# EAGLE design RH034.2 (EAGLE 7.7.0)
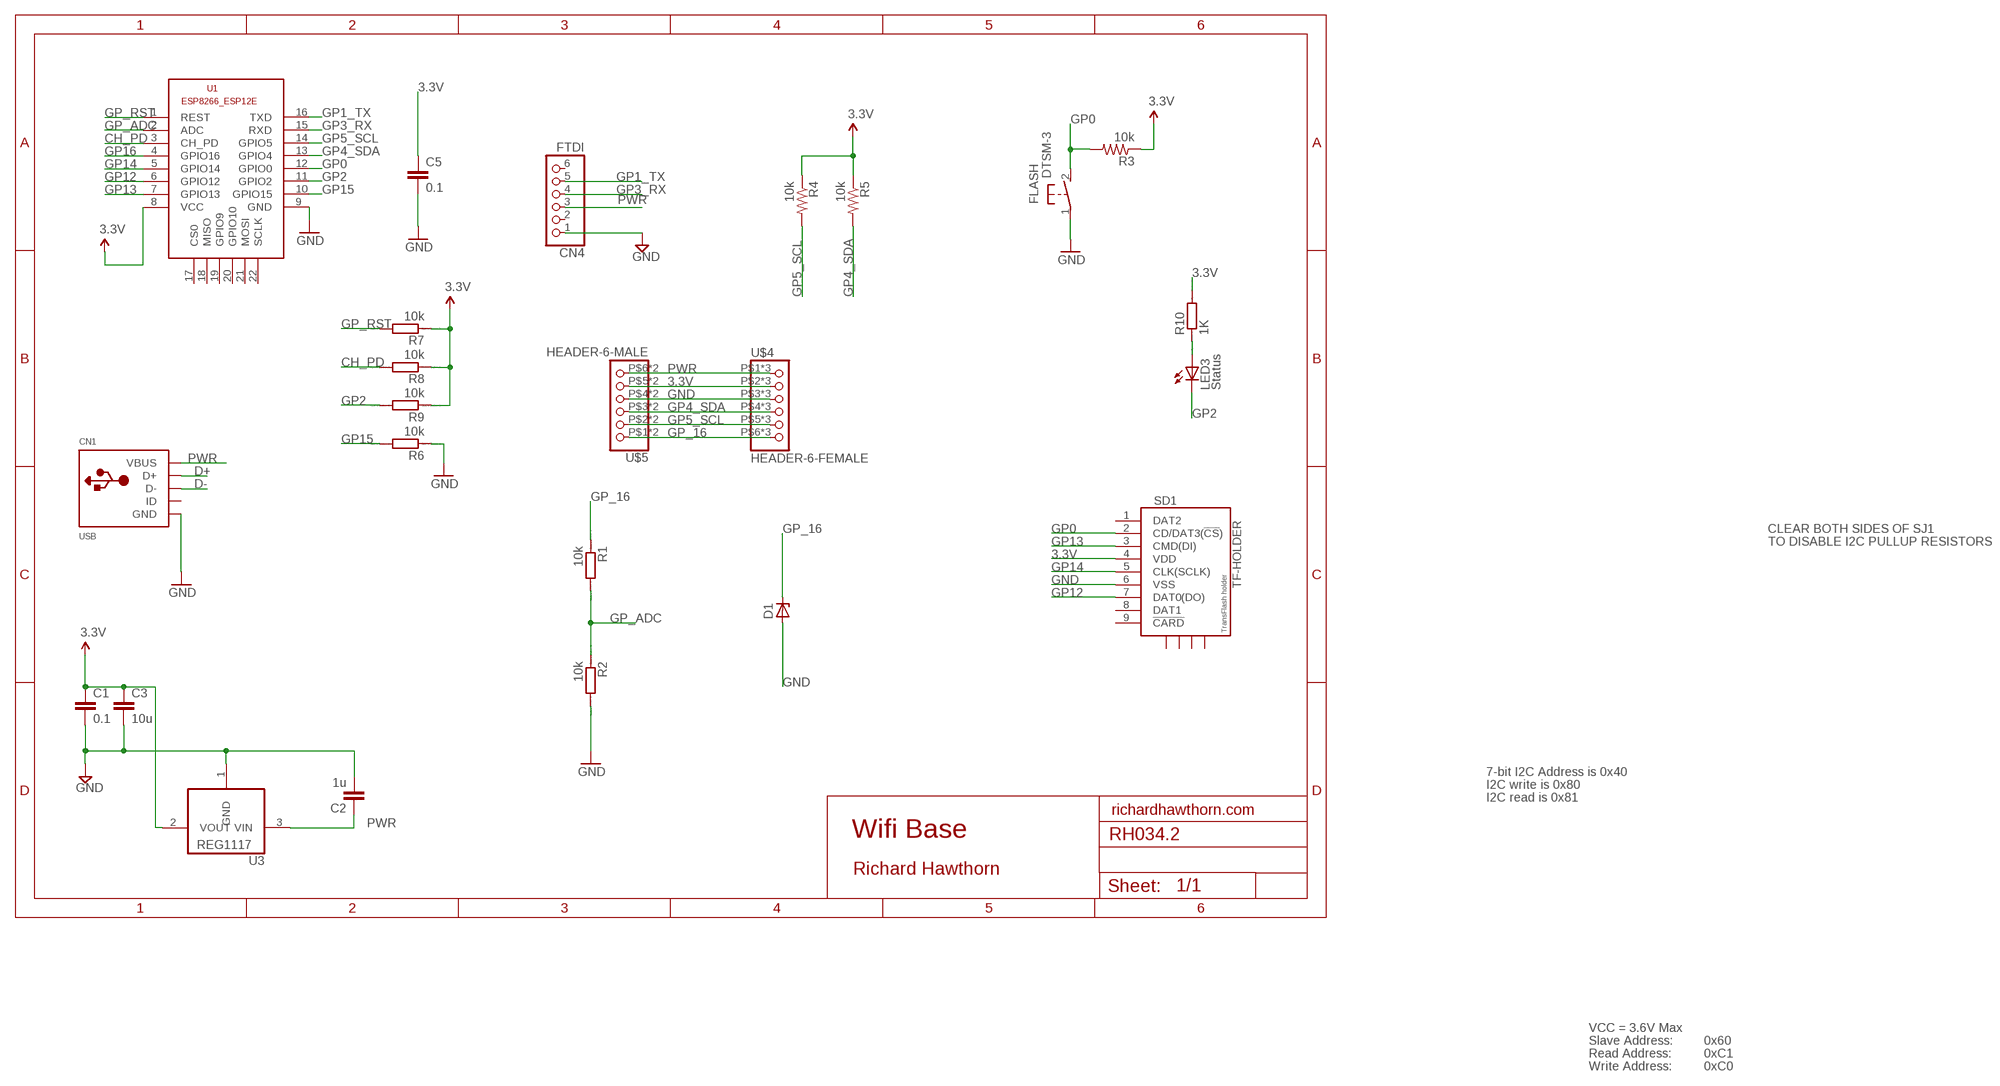
[diagram p0: schematic, sheet 1]

## Parts
C1  0.1  CAP0603-CAP  [0603-CAP]
C2  1u  CAP0603-CAP  [0603-CAP]
C3  10u  CAP0805-CAP  [0805-CAP]
C5  0.1  CAP0603-CAP  [0603-CAP]
CN1  USB  USBMINIB  [USB-MINIB]
CN4  FTDI  PINHD-1X6  [1X06]
D1  ZENER-DIODESOT23  [SOT23]
FLASH  DTSM-3  [DTSM-3]
LED3  Status  LEDCHIPLED_0805  [CHIPLED_0805]
R1  10k  R-EU_R0603  [R0603]
R2  10k  R-EU_R0603  [R0603]
R3  10k  RESISTOR0805-RES  [0805]
R4  10k  RESISTOR0805-RES  [0805]
R5  10k  RESISTOR0805-RES  [0805]
R6  10k  R-EU_R0603  [R0603]
R7  10k  R-EU_R0603  [R0603]
R8  10k  R-EU_R0603  [R0603]
R9  10k  R-EU_R0603  [R0603]
R10  1K  R-EU_R0603  [R0603]
SD1  TF-HOLDER  [TF-PULL]
U1  ESP8266-12EESP8266-ESP12E  [ESP8266-ESP12E]
U3  REG1117  [SOT223]
U$4  HEADER-6-FEMALE  [2MMHEADER6]
U$5  HEADER-6-MALE  [2MMHEADERPIN6]

## Nets
3.3V: C1.1 C3.1 C5.1 R3.1 R4.1 R5.1 R7.1 R8.1 R9.1 R10.2 SD1.4(VDD) U1.8(VCC) U3.2(VOUT) U$4.P$2 U$4.P$10 U$4.P$18 U$5.P$5 U$5.P$13
CH_PD: R8.2 U1.3(CH_PD)
D+: CN1.D+
D-: CN1.D-
GND [power]: C1.2 C2.2 C3.2 C5.2 CN1.GND CN4.1 D1.1(A) FLASH.1 R2.2 R6.1 SD1.6(VSS) U1.9(GND) U3.1(GND) U$4.P$3 U$4.P$11 U$4.P$19 U$5.P$4 U$5.P$12
GP0: FLASH.2 R3.2 SD1.2(CD/DAT3(!CS!)) U1.12(GPIO0)
GP1_TX: CN4.5 U1.16(TXD)
GP2: LED3.C R9.2 U1.11(GPIO2)
GP3_RX: CN4.4 U1.15(RXD)
GP4_SDA: R5.2 U1.13(GPIO4) U$4.P$4 U$4.P$12 U$4.P$20 U$5.P$3 U$5.P$11
GP5_SCL: R4.2 U1.14(GPIO5) U$4.P$5 U$4.P$13 U$4.P$21 U$5.P$2 U$5.P$10
GP12: SD1.7(DAT0(DO)) U1.6(GPIO12)
GP13: SD1.3(CMD(DI)) U1.7(GPIO13)
GP14: SD1.5(CLK(SCLK)) U1.5(GPIO14)
GP15: R6.2 U1.10(GPIO15)
GP16: U1.4(GPIO16)
GP_16: D1.3(C) R1.1 U$4.P$6 U$4.P$14 U$4.P$22 U$5.P$1 U$5.P$9
GP_ADC: R1.2 R2.1 U1.2(ADC)
GP_RST: R7.2 U1.1(REST)
N$1: LED3.A R10.1
PWR [power]: C2.1 CN1.VBUS CN4.3 U3.3(VIN) U$4.P$1 U$4.P$9 U$4.P$17 U$5.P$6 U$5.P$14
Unconnected: CN1.ID CN4.2 CN4.6 SD1.1(DAT2) SD1.8(DAT1) SD1.9(!CARD) SD1.S1 SD1.S2 SD1.S3 SD1.S4 U1.17(CS0) U1.18(MISO) U1.19(GPIO9) U1.20(GPIO10) U1.21(MOSI) U1.22(SCLK)

## Notes on the sheet
- CLEAR BOTH SIDES OF SJ1
- TO DISABLE I2C PULLUP RESISTORS
- 7-bit I2C Address is 0x40
- I2C write is 0x80
- I2C read is 0x81
- richardhawthorn.com
- Wifi Base
- Richard Hawthorn
- VCC = 3.6V Max
- Slave Address: | 0x60
- Read Address: | 0xC1
- Write Address: | 0xC0

## Library data of the parts
C1-C3 C5 = LowPowerLab:CAP: Capacitor Standard 0603 ceramic capacitor, and 0.1" leaded capacitor.
CN1 = LowPowerLab:USB: USB Connectors USBMINIB - Surface Mount Female Mini-B USB Connector 4UConnector: 06564 By microbuilder.eu Thru-hole RA Female Mini-B USB Connector 4UConnector: 18732 By ladyada.net
CN4 = Richards:PINHD-1X6: PIN HEADER
D1 = diode:ZENER-DIODE: Z-Diode
FLASH = switch-tact:DTSM-3
LED3 = led:LED: LED OSRAM: - CHIPLED LG R971, LG N971, LY N971, LG Q971, LY Q971, LO R971, LY R971 LH N974, LH R974 LS Q976, LO Q976, LY Q976 LO Q996 - Hyper CHIPLED LW Q18S LB Q993, LB Q99A, LB R99A - SideLED LS A670, LO A670, LY A670, LG A670, LP A670 LB A673, LV A673, LT A673, LW A673 LH A674 LY A675 LS A676, LA A676, LO A676, LY A676, LW A676 LS A679, LY A679, LG A679 - Hyper Micro SIDELED® LS Y876, LA Y876, LO Y876, LY Y876 LT Y87S - SmartLED LW L88C, LW L88S LB L89C, LB L89S, LG L890 LS L89K, LO L89K, LY L89K LS L896, LA L896, LO L896, LY L896 - TOPLED LS T670, LO T670, LY T670, LG T670, LP T670 LSG T670, LSP T670, LSY T670, LOP T670, LYG T670 LG T671, LOG T671, LSG T671 LB T673, LV T673, LT T673, LW T673 LH T674 LS T676, LA T676, LO T676, LY T676, LB T676, LH T676, LSB T676, LW T676 LB T67C, LV T67C, LT T67C, LS T67K, LO T67K, LY T67K, LW E67C LS E67B, LA E67B, LO E67B, LY E67B, LB E67C, LV E67C, LT E67C LW T67C LS T679, LY T679, LG T679 LS T770, LO T770, LY T770, LG T770, LP T770 LB T773, LV T773, LT T773, LW T773 LH T774 LS E675, LA E675, LY E675, LS T675 LS T776, LA T776, LO T776, LY T776, LB T776 LHGB T686 LT T68C, LB T68C - Hyper Mini TOPLED® LB M676 - Mini TOPLED Santana® LG M470 LS M47K, LO M47K, LY M47K Source: http://www.osram.convergy.de LUXEON: - LUMILED® LXK2-PW12-R00, LXK2-PW12-S00, LXK2-PW14-U00, LXK2-PW14-V00 LXK2-PM12-R00, LXK2-PM12-S00, LXK2-PM14-U00 LXK2-PE12-Q00, LXK2-PE12-R00, LXK2-PE12-S00, LXK2-PE14-T00, LXK2-PE14-U00 LXK2-PB12-K00, LXK2-PB12-L00, LXK2-PB12-M00, LXK2-PB14-N00, LXK2-PB14-P00, LXK2-PB14-Q00 LXK2-PR12-L00, LXK2-PR12-M00, LXK2-PR14-Q00, LXK2-PR14-R00 LXK2-PD12-Q00, LXK2-PD12-R00, LXK2-PD12-S00 LXK2-PH12-R00, LXK2-PH12-S00 LXK2-PL12-P00, LXK2-PL12-Q00, LXK2-PL12-R00 Source: www.luxeon.com KINGBRIGHT: KA-3528ASYC Source: www.kingbright.com
R1 R2 R6-R10 = resistor:R-EU_: RESISTOR, European symbol; SPICEPREFIX: R
R3-R5 = SparkFun:RESISTOR: Resistor Basic schematic elements and footprints for 0603, 1206, and PTH resistors.
SD1 = sd_mmc:TF-HOLDER: TF / Micro SD socket is PUSH-PUSH type, the card can be pushed into and auto locked and pushed out by simply press the card. Surface Mounting type.
U1 = ESP8266-ESP12E:ESP8266-12E: ESP8266-12E with additional I/O and GPIO04/05 corrected The author cannot warrant that this library is free from error or will meet your specific requirements. Created by PuceBaboon.com. Komagane, Nagano, JAPAN
U3 = burr-brown:REG1117: 800mA and 1A Low Dropout (LDO) Positive Regulator 1.8V, 2.5V, 2.85V, 3.3V, 5V, and Adj; MPN: REG1117; OC_FARNELL: 1097566; OC_NEWARK: 14P6981
U$4 = Richards:HEADER-6-FEMALE
U$5 = Richards:HEADER-6-MALE

## Net classes
1 power: width 0.381 mm, clearance 0.254 mm

## Board
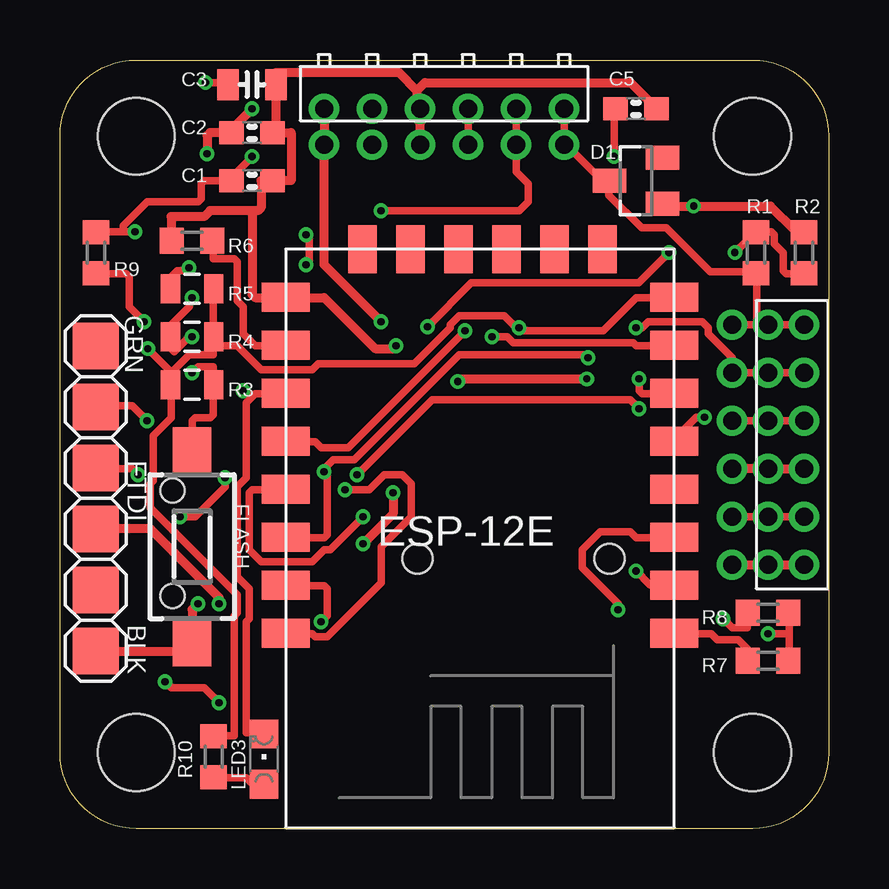
[diagram p1: board, top side]
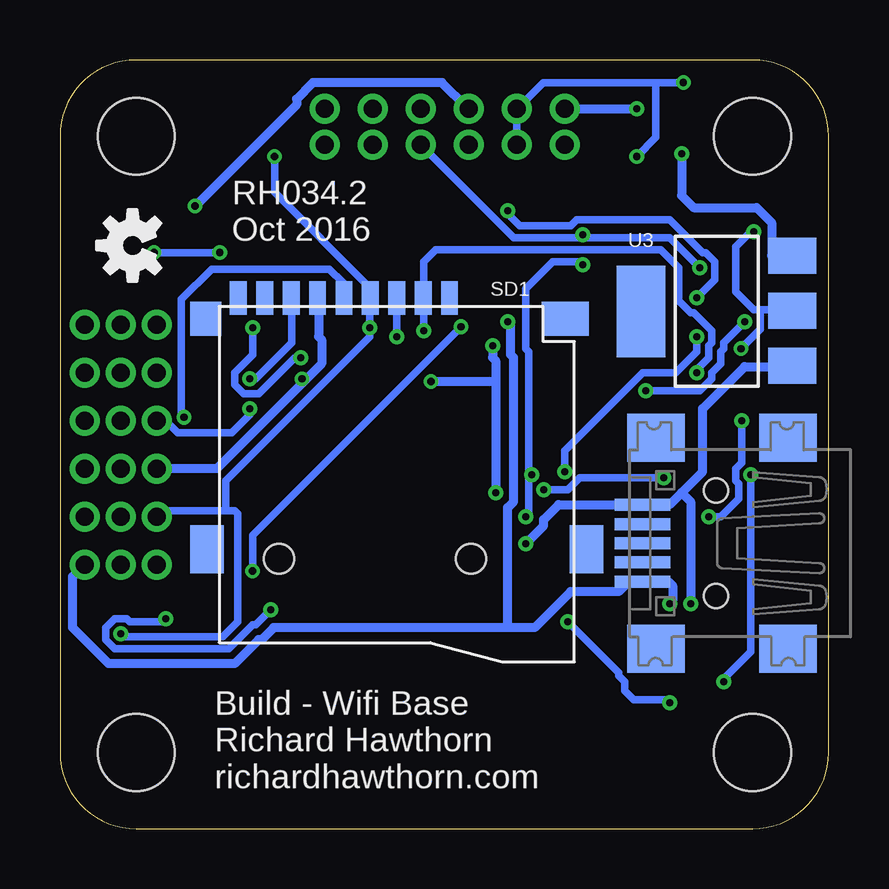
[diagram p2: board, bottom side, seen from below]

Size 32.03 x 32.03 mm. Coordinates in mm from the lower left corner, seen from the top.
Outline: 0,3.17 0,28.86 arc-90 3.17,32.03 28.86,32.03 arc-90 32.03,28.86 32.03,3.17 arc-90 28.86,0 3.17,0 arc-90 0,3.17
Copper layers (1*16): Top 0.035mm / dielectric 1.5mm / Bottom 0.035mm
Design rules "ITEADstudio_DRC *": minimum track width 12mil, minimum drill 12mil, track to track 6mil, track to pad 6mil, pad to pad 6mil, via to via 6mil, smd to smd 0mil, copper to edge 10mil, drill to drill 10mil, minimum pad ring 10mil, minimum via ring 6mil, stop-mask expansion 2mil, vias tented up to drill 100mil, thermal gap 15mil
Holes 3.2 mm at 3.17,3.17 28.86,3.17 3.17,28.86 28.86,28.86
tRestrict: area 0,0 to 5.7,5.7; area 26.3,26.3 to 32,32; area 9,0 to 32,6.5; area 0,26.3 to 5.7,32
bRestrict: area 0,26.3 to 5.7,32; area 9,0 to 32,6.5; area 26.3,26.3 to 32,32; area 0,0 to 5.7,5.7

### Footprints (pad centres in the part's own frame; a part is rotated, then mirrored left to right if it is on the bottom)
0603-CAP = smd 1.016 x 0.965: 1 -0.85,0; 2 0.85,0
0805-CAP = smd 0.902 x 1.3: 1 -1,0; 2 1,0
USB-MINIB = smd 0.5 x 2.308: D+ 0,4.064; D- -0.8,4.064; GND 1.6,4.064; ID 0.8,4.064; VBUS -1.6,4.064 | smd 2 x 2.4: GND1 -4.4,-2; GND2 -4.4,3.5; GND3 4.4,3.5; GND4 4.4,-2 | hole 1: -2.2,1; 2.2,1
1X06 = smd 1.93 x 1.93: 1 -6.35,0; 2 -3.81,0; 3 -1.27,0; 4 1.27,0; 5 3.81,0; 6 6.35,0
SOT23 = smd 1 x 1.4: 1 -0.95,-1.1; 2 0.95,-1.1; 3 0,1.1
DTSM-3 = smd 2 x 1.6: 1 -3.97,0; 2 3.97,0
CHIPLED_0805 = smd 1.2 x 1.2: A 0,-1.05; C 0,1.05
R0603 = smd 1 x 1.1: 1 -0.85,0; 2 0.85,0
0805 = smd 0.8 x 1.2: 1 -0.9,0; 2 0.9,0
TF-PULL = smd 0.7 x 1.4: 1 -2.2,-7.62; 2 -1.1,-7.62; 3 0,-7.62; 4 1.1,-7.62; 5 2.2,-7.62; 6 3.3,-7.62; 7 4.4,-7.62; 8 5.5,-7.62; 9 6.6,-7.62 | smd 1.4 x 2: S1 -7.9,2.85; S2 7.9,2.85 | smd 1.28 x 1.4: S3 7.96,-6.75 | smd 1.95 x 1.4: S4 -7.025,-6.75 | hole 1.25: -3.1,3.25; 4.9,3.25
ESP8266-ESP12E = smd 2 x 1.2: 1 0,16; 2 0,14; 3 0,12; 4 0,10; 5 0,8; 6 0,6; 7 0,4; 8 0,2; 9 16.2,2; 10 16.2,4; 11 16.2,6; 12 16.2,8; 13 16.2,10; 14 16.2,12; 15 16.2,14; 16 16.2,16 | smd 1.2 x 2: 17 11,0; 18 3,0; 19 5,0; 20 13,0; 21 7,0; 22 9,0
SOT223 = smd 1.499 x 2.007: 1 -2.261,-3.15; 2 0.025,-3.15; 3 2.311,-3.15 | smd 3.81 x 2.007: 4 0,3.15
2MMHEADER6 = drill 0.75: P$1 1,5; P$2 1,3; P$3 1,1; P$4 1,-1; P$5 1,-3; P$6 1,-5; P$9 -0.5,5; P$10 -0.5,3; P$11 -0.5,1; P$12 -0.5,-1; P$13 -0.5,-3; P$14 -0.5,-5; P$17 -2,5; P$18 -2,3; P$19 -2,1; P$20 -2,-1; P$21 -2,-3; P$22 -2,-5
2MMHEADERPIN6 = drill 0.75: P$1 1,5; P$2 1,3; P$3 1,1; P$4 1,-1; P$5 1,-3; P$6 1,-5; P$9 -0.5,5; P$10 -0.5,3; P$11 -0.5,1; P$12 -0.5,-1; P$13 -0.5,-3; P$14 -0.5,-5

### Placement (x,y rotation side)
C1  8,27 0 top
C2  8,29 0 top
C3  8,31 0 top
C5  24,30 0 top
CN1  3.69,11.89 90 bottom
CN4  1.49,13.76 90 top
D1  24,27 90 top
FLASH  5.5,11.75 90 top
LED3  8.5,2.9 0 top
R1  29,24 90 top
R2  31,24 90 top
R3  5.5,18.5 0 top
R4  5.5,20.5 180 top
R5  5.5,22.5 180 top
R6  5.5,24.5 0 top
R7  29.5,7 180 top
R8  29.5,9 180 top
R9  1.5,24 270 top
R10  6.4,3 90 top
SD1  18,14.5 180 bottom
U1  25.6,24.15 180 top
U3  4.67,21.55 90 bottom
U$3  [OSHW-LOGO-S]  29,24.3 90 bottom
U$4  29,16 180 top
U$5  16,29.5 270 top

### Tracks (layer width: path | path; a pad name or v marks a point on that pad's centre or on a via)
3.3V  (via drill 0.3)
  Top 0.305: v3.12,24.88 2.62,24.88 | 2.62,24.88 1.5,24.88 R9.1 | 2.62,24.88 2.62,25.12 3.62,26.12 5.75,26.12 5.88,26.25 5.88,26.88 6,27 C1.1 7.09,27.09 v8,28 | R4.1 6.38,20.5 6.38,22.5 R5.1 | R10.2 6.5,3.88 7.25,3.88 7.25,8.88 7.38,9 7.38,9.75 3.75,13.38 3.75,14.38 3.88,14.5 3.88,16.38 4.62,17.12 4.62,18.5 R3.1 | R4.1 6.38,20.38 6.38,19.75 5.38,19.75 4.62,19 4.62,18.62 R3.1 | U1.8 25.5,22.12 24,22.12 22.62,20.75 19.25,20.75 v19.12,20.88 19,20.88 18.5,21.38 16.62,21.38 16.25,21 16.25,20.88 14.75,19.38 10.75,19.38 10.5,19.12 8.38,19.12 7.38,20.12 6.5,20.12 R4.1 | 30.38,8.12 30.38,9 R8.1 | 30.38,8.12 30.38,7 R7.1 | U$4.P$2 U$4.P$10 U$4.P$18 | v29.5,8.12 30.38,8.12 | v6.06,31.09 6.97,31.09 C3.1 | v23.09,28 23.09,29.95 C5.1 | v3.66,20 4.57,19.09 R3.1
  Bottom 0.305: v3.12,24.88 3.25,24.88 3.88,24.25 3.88,22.38 3.12,21.62 2.86,21.62 | 2.86,21.62 1.62,21.62 U3.2 | U$5.P$5 U$5.P$13 12.92,30.06 11.89,31.09 7.2,31.09 | v29.5,8.12 29.38,8 25.25,8 24.62,8.62 24.62,13.12 24.75,13.25 25.12,13.25 | 25.12,13.25 27.75,13.25 U$4.P$2 | 25.12,13.25 25.12,14.5 19.12,20.5 v19.12,20.88 19.12,22 SD1.4 19.2,22.17 19.2,22.63 23.09,26.52 v23.09,28 | 7.2,31.09 v6.06,31.09 | 7.2,31.09 7.2,28.8 v8,28 | 2.86,21.62 2.86,20.8 v3.66,20
CH_PD  (via drill 0.3)
  Top 0.305: v27.62,8.75 28,8.38 28.62,8.38 28.62,9 R8.2 | v23.25,9.12 23.25,9.38 21.75,10.88 21.75,11.62 22.5,12.38 23.75,12.38 24,12.12 25.5,12.12 U1.3
  Bottom 0.305: v27.62,8.75 27.75,8.62 29.12,8.62 29.25,8.75 29.75,8.75 30.12,8.38 30.12,7.88 29.75,7.5 25,7.5 24,8.5 23.88,8.5 v23.25,9.12
GND  (via drill 0.3)
  Top 0.381: CN4.1 1.5,7.38 5.5,7.38 FLASH.1 5.5,9.12 v5.75,9.38 | 8,25.75 8.25,25.75 8.38,25.88 8.38,27 C1.2 9.62,27 9.62,29 C2.2 9,29.12 C3.2 9,31.5 14.12,31.5 14.87,30.76 | 8,25.75 6.25,25.75 6,25.5 4.62,25.5 4.62,24.5 R6.1 | 8,25.75 8,22.25 8.12,22.12 9.38,22.12 U1.9 9.5,22.12 11,22.12 13.12,20 13.88,20 v14,20.12 | U$4.P$3 U$4.P$11 U$4.P$19 | U$5.P$4 U$5.P$12 14.88,30.12 14.88,30.75 14.87,30.76 | v12.62,11.88 13.88,13.12 v13.88,14 | R2.2 30.98,24.92 30.63,24.92 29.6,25.95 v26.4,25.95 25.15,25.95 D1.1 | 14.87,30.76 15.2,31.09 23.77,31.09 24.8,30.06 C5.2 | v21.95,18.75 16.69,18.75 v16.57,18.63
  Bottom 0.381: 6.12,14 6.62,13.5 CN1.GND 7.88,13.5 11.25,13.5 11.88,12.88 11.88,12.62 v12.62,11.88 | 6.12,14 5.25,14.88 5.25,17.5 3.5,19.25 1.62,19.25 U3.1 | v5.75,9.38 5.75,13.62 6.12,14 | U$4.P$3 25.5,15 21.85,18.65 | 21.85,18.65 21.12,19.38 21.12,20.38 21.25,20.5 21.25,22 SD1.6 | 13.88,18.63 13.88,19.5 14,19.62 v14,20.12 | 13.88,18.63 v13.88,14 | v26.4,25.95 22.17,30.18 22.17,30.4 21.49,31.09 16.12,31.09 15.09,30.06 U$5.P$12 | 13.88,18.63 v16.57,18.63 | v21.95,18.75 21.85,18.65
GP0  (via drill 0.3)
  Top 0.305: FLASH.2 5.5,17 5.62,17.12 6.25,17.12 6.38,17.25 6.38,18.5 R3.2 6.38,18.62 6.38,19.25 5.75,19.25 v5.5,19 | v16.88,20.75 12,15.88 10.88,15.88 10.62,16.12 9.5,16.12 U1.12
  Bottom 0.305: v16.88,20.75 16.88,22 SD1.2 16.88,22.25 16.88,23.62 16.38,24.12 7,24.12 6.25,23.38 6.25,22 5.75,21.5 5.62,21.5 4.88,20.75 4.88,20.25 5,20.12 5,19.62 5.5,19.12 v5.5,19
GP1_TX  (via drill 0.3)
  Top 0.305: v3.62,17 3,17.62 1.5,17.62 CN4.5 | v5,13 5.62,13 6.88,14.25 v6.88,14.62 | v11.88,14.12 12.88,14.12 13.5,14.75 14.25,14.75 14.62,14.38 14.62,13 13.38,11.75 13.38,10.25 11.12,8 10.62,8 10.5,8.12 9.5,8.12 U1.16
  Bottom 0.305: v3.62,17 3.62,15.25 3.88,15 3.88,14.5 3.75,14.38 3.75,13.75 4.5,13 v5,13 | v6.88,14.62 10.38,14.62 10.88,14.12 v11.88,14.12
GP2  (via drill 0.3)
  Top 0.305: 8,18 7.75,17.75 7.75,14.62 7.38,14.25 7.38,10.5 7.88,10 7.88,8.75 7.75,8.62 7.75,4 8.5,4 LED3.C | 8,18 8.12,18.12 9.38,18.12 U1.11 | v3.5,21.12 2.88,21.75 2.88,23 2.75,23.12 1.5,23.12 R9.2 | v7.62,18.25 7.75,18.25 8,18
  Bottom 0.305: v3.5,21.12 4.38,20.25 4.38,20 4.5,19.88 4.5,19.38 4.88,19 4.88,18.75 5.38,18.25 v7.62,18.25
GP3_RX  (via drill 0.3)
  Top 0.305: v3.25,14.75 3,15 1.5,15 CN4.4 | v4.38,6.12 4.62,5.88 6,5.88 v6.62,5.25 | v10.88,8.62 11.12,8.88 11.12,10 11,10.12 9.5,10.12 U1.15
  Bottom 0.305: v3.25,14.75 3.25,7.38 4.38,6.25 v4.38,6.12 | v6.62,5.25 6.75,5.38 8.12,5.38 8.5,5.75 8.5,6.12 8.75,6.38 8.75,6.5 v10.88,8.62
GP4_SDA  (via drill 0.3)
  Top 0.305: U$4.P$4 U$4.P$12 U$4.P$20 | U$5.P$3 U$5.P$11 | v5.38,23.38 5.25,23.25 4.88,23.25 4.62,23 4.62,22.5 R5.2 | v12.62,13 11.25,11.62 11,11.62 10.5,11.12 8.38,11.12 7.88,11.62 7.88,14 8,14.12 9.38,14.12 U1.13 | v10.25,23.5 10.38,23.62 10.38,24.62 v10.25,24.75 | v24.12,17.5 23.75,17.88 15.5,17.88 v12.38,14.75
  Bottom 0.305: v5.38,23.38 6.62,24.62 10.25,24.62 | 10.25,24.62 13.12,24.62 U$5.P$3 | v12.62,13 12.5,13.12 12.5,14.75 | 12.5,14.75 12.5,19.88 12.62,20 12.62,22.5 11.5,23.62 10.38,23.62 v10.25,23.5 | v10.25,24.75 10.25,24.62 | U$4.P$4 27.62,17 27.12,16.5 24.88,16.5 24.12,17.25 v24.12,17.5 | v12.38,14.75 12.5,14.75
GP5_SCL  (via drill 0.3)
  Top 0.305: U$4.P$21 U$4.P$13 U$4.P$5 28,19.62 27,20.62 27,20.88 26.75,21.12 24.5,21.12 24.25,20.88 v24,20.88 | U$5.P$10 U$5.P$2 19,27.38 19.5,26.88 19.5,26.12 19.12,25.75 v13.38,25.75 | v5.5,20.5 5.38,20.38 5.25,20.38 4.75,19.88 4.62,20 4.62,20.5 R4.2 4.62,20.62 4.62,21 5.38,21.75 5.38,22 v5.5,22.12 | U1.14 9.5,12.12 11,12.12 11.12,12.25 11.12,14.75 v11,14.88 11,15 11.38,15.38 12.25,15.38 16.62,19.75 21.88,19.75 v22,19.62
  Bottom 0.305: v11,14.88 11,15.75 7.75,19 6.38,19 5.5,19.88 v5.5,20.5 | v13.38,25.75 13.38,25.62 12.88,25.12 10.75,25.12 10.5,25.38 6.62,25.38 5.25,24 5.12,24 4.75,23.62 4.75,22.88 v5.5,22.12 | v24,20.88 24,19.75 24.75,19 24.75,18.5 24.38,18.12 23.75,18.12 22.25,19.62 v22,19.62
GP12  (via drill 0.3)
  Top 0.305: v24.12,18.75 24.12,18.25 24.25,18.12 25.5,18.12 U1.6
  Bottom 0.305: v24.12,18.75 23.88,18.75 22.38,20.25 22.38,22 SD1.7
GP13  (via drill 0.3)
  Top 0.305: v18,20.5 18.62,20.5 18.88,20.25 23.88,20.25 24,20.12 25.5,20.12 U1.7
  Bottom 0.305: v18,20.5 SD1.3
GP14  (via drill 0.3)
  Top 0.305: v26.86,17.14 26.52,17.14 25.6,16.23 U1.5
  Bottom 0.305: v26.86,17.14 26.98,17.26 26.98,22.06 25.72,23.32 20.8,23.32 20.23,22.75 20.23,22.17 SD1.5
GP15
  Top 0.305: U1.10 9.38,20.12 8.12,20.12 7.62,20.62 7.62,21.75 7.38,22 7.38,23.62 7.25,23.75 6.38,23.75 6.38,24.5 R6.2
GP_16
  Top 0.305: U$5.P$9 U$5.P$1 21.14,28.46 22.52,27.09 22.86,27.09 D1.3 22.86,26.86 22.86,26.4 24.23,25.03 25.26,25.03 27.09,23.2 28.92,23.2 R1.1 29.03,23.09 29.03,21.14 U$4.P$14 | U$4.P$6 U$4.P$14 | U$4.P$14 U$4.P$22
GP_ADC  (via drill 0.3)
  Top 0.305: R2.1 31,23.12 30.25,23.12 30.12,23.25 30.12,24 29.75,24.38 29.75,24.75 29.62,24.88 29,24.88 R1.2 28.92,24.8 v28.12,24 | v24,10.74 24.57,10.17 25.49,10.17 U1.2 | v15.32,20.92 17.14,22.75 24.12,22.75 v25.38,24
  Bottom 0.305: v24,10.74 24,12.23 v15.32,20.92 | v28.12,24 v25.38,24
GP_RST
  Top 0.305: R7.2 28.62,7 28.62,7.5 28.25,7.88 27.38,7.88 27.12,8.12 25.62,8.12 U1.1
N$1
  Top 0.305: R10.1 6.5,2.12 7.75,2.12 8,1.88 8.5,1.88 LED3.A
PWR  (via drill 0.3)
  Top 0.381: U$5.P$14 U$5.P$6 11,23.5 v13.38,21.12 | v8,30 7.25,29.25 7.25,29 C2.1 6.25,29 6.12,28.88 v6.12,28.12 | U$4.P$1 U$4.P$9 U$4.P$17 | v6.62,9.38 6.62,9.62 3.75,12.5 CN4.3
  Bottom 0.381: U$5.P$14 v8,30 | v6.12,28.12 6.12,26.38 5.62,25.88 3,25.88 2.38,25.25 2.38,23.88 1.62,23.88 U3.3 | v6.62,9.38 6.5,9.5 6.5,10.12 6.62,10.25 7.75,10.25 CN1.VBUS 7.88,10.25 8.38,10.25 8.75,9.88 10.75,9.88 12.25,8.38 13.38,8.38 | U$4.P$17 31.5,10.5 31.5,8.38 30,6.88 24.75,6.88 23.75,7.88 23.62,7.88 23.12,8.38 13.38,8.38 | v13.38,21.12 13.25,21 13.25,19.75 13.12,19.62 13.12,13.62 13.38,13.38 13.38,8.38

### Text on the board
tPlace: GRN | FTDI | BLK
bPlace: RH034.2 / Oct 2016 | Build - Wifi Base / Richard Hawthorn / richardhawthorn.com
tDocu: REG